# EAGLE design sheild (EAGLE 5.10)
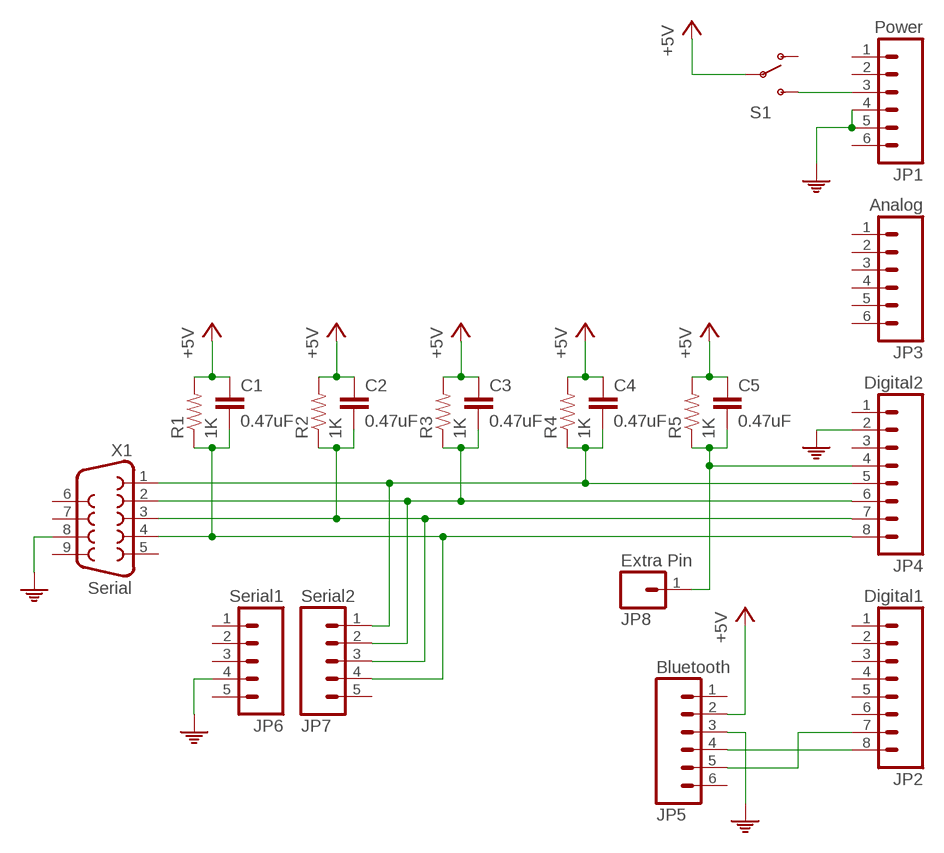
[diagram p0: schematic, sheet 1]

## Parts
C1  0.47uF  CAP0603-CAP  [0603-CAP]
C2  0.47uF  CAP0603-CAP  [0603-CAP]
C3  0.47uF  CAP0603-CAP  [0603-CAP]
C4  0.47uF  CAP0603-CAP  [0603-CAP]
C5  0.47uF  CAP0603-CAP  [0603-CAP]
JP1  Power  M06SIP  [1X06]
JP2  Digital1  M08  [1X08]
JP3  Analog  M06SIP  [1X06]
JP4  Digital2  M08  [1X08]
JP5  Bluetooth  M06SIP  [1X06]
JP6  Serial1  M05  [1X05]
JP7  Serial2  M05  [1X05]
JP8  Extra Pin  M01PTH  [1X01]
R1  1K  RESISTOR0603-RES  [0603-RES]
R2  1K  RESISTOR0603-RES  [0603-RES]
R3  1K  RESISTOR0603-RES  [0603-RES]
R4  1K  RESISTOR0603-RES  [0603-RES]
R5  1K  RESISTOR0603-RES  [0603-RES]
S1  SWITCH-SPSTSMD  [AYZ0202]
X1  Serial  DB9  [DB9]

## Nets
+5V: C1.1 C2.1 C3.1 C4.1 C5.1 JP5.2 R1.2 R2.2 R3.2 R4.2 R5.2 S1.2(P)
N$1: JP2.8 JP5.4
N$2: JP2.7 JP5.5
N$3: JP1.3 S1.3(S)
N$4: C3.2 JP4.6 JP7.2 R3.1 X1.2
N$5: C4.2 JP4.5 JP7.1 R4.1 X1.1
N$6: C5.2 JP4.4 JP8.1 R5.1
N$16: C1.2 JP4.8 JP7.4 R1.1 X1.4
PE: JP1.4 JP1.5 JP4.2 JP5.3 JP6.4 X1.8
X1: C2.2 JP4.7 JP7.3 R2.1 X1.3
Unconnected: JP1.1 JP1.2 JP1.6 JP2.1 JP2.2 JP2.3 JP2.4 JP2.5 JP2.6 JP3.1 JP3.2 JP3.3 JP3.4 JP3.5 JP3.6 JP4.1 JP4.3 JP5.1 JP5.6 JP6.1 JP6.2 JP6.3 JP6.5 JP7.5 S1.1(O) X1.5 X1.6 X1.7 X1.9

## Library data of the parts
C1-C5 = SparkFun:CAP: Capacitor Standard 0603 ceramic capacitor, and 0.1" leaded capacitor.
JP1 JP3 JP5 = SparkFun-3-2-07:M06: Header 6 Standard 6-pin 0.1" header. Use with straight break away headers (SKU : PType-HD), right angle break away headers (PType-HD-RightAngle), swiss pins (PType-30F), machine pins (PType-MP), and female headers (PType-FH). Molex polarized connector foot print use with SKU : Con-Hdr with associated crimp pins and housings.
JP2 JP4 = SparkFun-3-2-07:M08: Header 8 Standard 8-pin 0.1" header. Use with straight break away headers (SKU : PType-HD), right angle break away headers (PType-HD-RightAngle), swiss pins (PType-30F), machine pins (PType-MP), and female headers (PType-FH). Molex polarized connector foot print use with SKU : Con-Hdr with associated crimp pins and housings.
JP6 JP7 = SparkFun-3-2-07:M05: Header 5 Standard 5-pin 0.1" header. Use with straight break away headers (SKU : PType-HD), right angle break away headers (PType-HD-RightAngle), swiss pins (PType-30F), machine pins (PType-MP), and female headers (PType-FH). Molex polarized connector foot print use with SKU : Con-Hdr with associated crimp pins and housings.
JP8 = SparkFun-3-2-07:M01: Header 1 Standard 1-pin 0.1" header. Use with straight break away headers (SKU : PType-HD), right angle break away headers (PType-HD-RightAngle), swiss pins (PType-30F), machine pins (PType-MP), and female headers (PType-FH).
R1-R5 = SparkFun:RESISTOR: Resistor Basic schematic elements and footprints for 0603, 1206, and PTH 1/10th watt (small) resistors.
S1 = SparkFun:SWITCH-SPST: SPST Switch Simple slide switch. Spark Fun Electronics SKU : COM-00102
X1 = SparkFun-3-2-07:DB9: DB9 Connector Standard DB9 (D-Sub 9) serial connector. Can be used for CAN bus as well as RS485 and RS232. Footprint production proven. Spark Fun Electronics SKU : PType-DB9-PCB

## Board
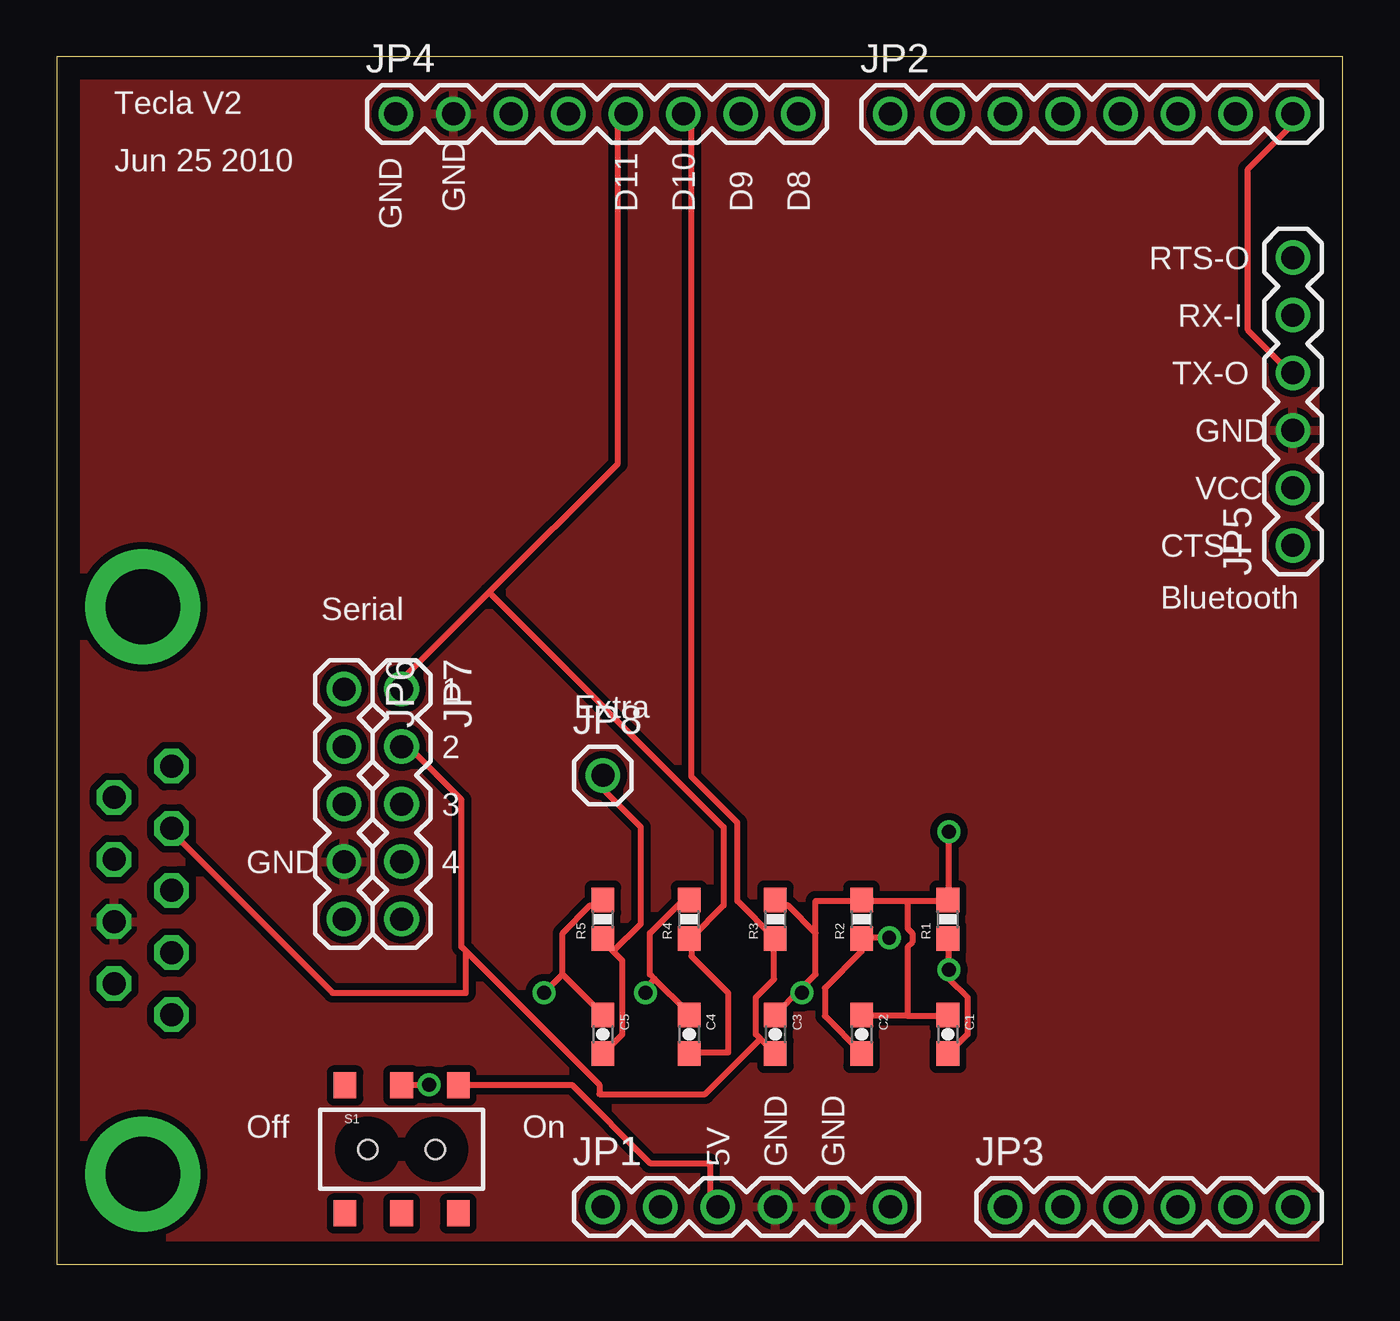
[diagram p1: board, top side]
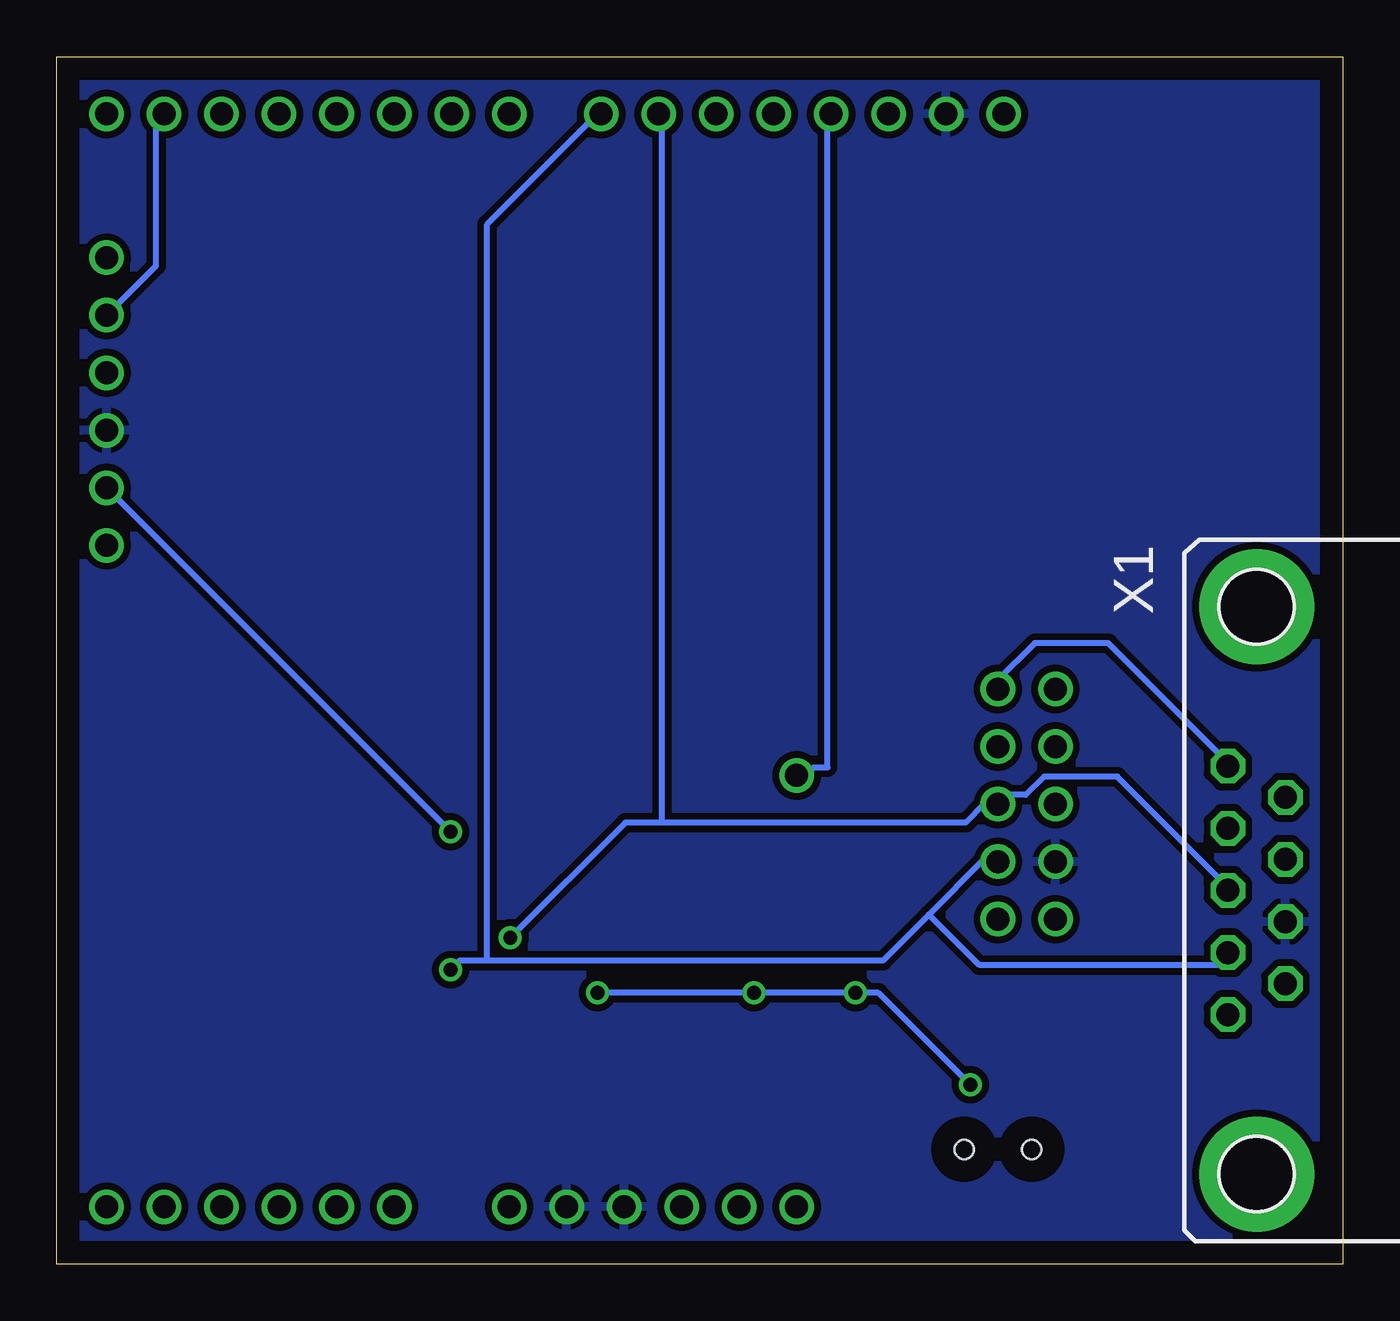
[diagram p2: board, bottom side, seen from below]

Size 56.82 x 53.33 mm. Coordinates in mm from the lower left corner, seen from the top.
Outline: 0,0 56.82,0 56.82,53.33 0,53.33 0,0
Copper layers (1*16): Top 0.035mm / dielectric 1.5mm / Bottom 0.035mm
Design rules "default *": minimum track width 10mil, minimum drill 24mil, track to track 8mil, track to pad 8mil, pad to pad 8mil, via to via 8mil, smd to smd 8mil, copper to edge 40mil, drill to drill 8mil, minimum pad ring 10mil, minimum via ring 8mil, stop-mask expansion 4mil, vias tented up to drill 0mil, thermal gap 10mil

### Footprints (pad centres in the part's own frame; a part is rotated, then mirrored left to right if it is on the bottom)
0603-CAP = smd 1.1 x 1: 1 -0.85,0; 2 0.85,0
1X06 = drill 1.016 round: 1 0,0; 2 2.54,0; 3 5.08,0; 4 7.62,0; 5 10.16,0; 6 12.7,0
1X08 = drill 1.016 round: 1 0,0; 2 2.54,0; 3 5.08,0; 4 7.62,0; 5 10.16,0; 6 12.7,0; 7 15.24,0; 8 17.78,0
1X05 = drill 1.016 round: 1 0,0; 2 2.54,0; 3 5.08,0; 4 7.62,0; 5 10.16,0
1X01 = drill 1.016 round: 1 0,0
0603-RES = smd 1.1 x 1: 1 -0.85,0; 2 0.85,0
AYZ0202 = smd 1 x 1.15: 1 -2.5,2.825; 2 0,2.825; 3 2.5,2.825; 4 -2.5,-2.825; 5 0,-2.825; 6 2.5,-2.825 | hole 0.85: 1.5,0; -1.5,0
DB9 = drill 1.016 octagon: 1 -5.486,-1.27; 2 -2.743,-1.27; 3 0,-1.27; 4 2.743,-1.27; 5 5.486,-1.27; 6 -4.115,1.27; 7 -1.372,1.27; 8 1.372,1.27; 9 4.115,1.27 | drill 3.302 pad 5.08 round: G1 -12.522,0; G2 12.522,0

### Placement (x,y rotation side)
C1  39.37,10.16 270 top
C2  35.56,10.16 270 top
C3  31.75,10.16 270 top
C4  27.94,10.16 270 top
C5  24.13,10.16 270 top
JP1  24.13,2.54 0 top
JP2  36.83,50.8 0 top
JP3  41.91,2.54 0 top
JP4  14.99,50.8 0 top
JP5  54.61,31.75 90 top
JP6  12.7,25.4 270 top
JP7  15.24,25.4 270 top
JP8  24.13,21.59 0 top
R1  39.37,15.24 90 top
R2  35.56,15.24 90 top
R3  31.75,15.24 90 top
R4  27.94,15.24 90 top
R5  24.13,15.24 90 top
S1  15.24,5.08 0 top
X1  3.81,16.51 270 bottom

### Tracks (layer width: path | path; a pad name or v marks a point on that pad's centre or on a via)
+5V  (via drill 0.61)
  Top 0.254: 26.42,12.6 26.21,12.8 26.21,14.63 27.84,16.26 R4.2 | 26.42,12.6 27.84,11.18 C4.1 | 22.35,12.8 23.98,11.18 C5.1 | 22.35,12.8 22.35,14.63 23.57,15.85 23.98,15.85 23.98,16.05 R5.2 | v16.46,7.92 15.24,7.92 S1.2 | v21.54,11.99 22.35,12.8 | 26.42,12.6 26.01,12.19 v26.01,11.99 | 37.59,10.97 39.22,10.97 C1.1 | 37.59,10.97 35.56,10.97 C2.1 | 32.72,11.99 33.53,12.8 33.53,14.63 | 32.72,11.99 31.9,11.18 C3.1 | 33.53,14.63 32.31,15.85 31.9,15.85 31.9,16.05 R3.2 | 35.56,16.05 33.53,16.05 33.53,14.63 | 35.56,16.05 37.59,16.05 | 37.59,16.05 39.22,16.05 R1.2 39.42,16.26 v39.42,19.1 | 35.56,16.05 R2.2 | 37.59,10.97 37.59,14.02 37.8,14.22 37.8,14.63 37.59,14.83 37.59,16.05 | v32.92,11.99 32.72,11.99
  Bottom 0.254: v16.46,7.92 20.52,11.99 v21.54,11.99 v26.01,11.99 v32.92,11.99 | v39.42,19.1 JP5.2
N$1
  Top 0.254: JP5.4 54.46,39.42 52.63,41.25 52.63,48.36 54.46,50.19 54.46,50.8 JP2.8
N$2
  Bottom 0.254: JP5.5 52.43,44.09 52.43,50.8 JP2.7
N$3
  Top 0.254: S1.3 17.88,7.92 22.76,7.92 26.21,4.47 28.85,4.47 28.85,2.85 29.06,2.64 JP1.3
N$4
  Top 0.254: 31.09,9.96 30.89,10.16 30.89,11.79 31.7,12.6 31.7,14.22 R3.1 31.7,14.43 30.07,16.05 30.07,19.51 28.04,21.54 28.04,50.6 27.84,50.8 JP4.6 | 31.09,9.96 31.7,9.35 C3.2 | 31.09,9.96 28.65,7.52 23.98,7.52 23.98,7.92 18.09,13.82 | 18.09,13.82 17.88,14.02 17.88,20.52 15.65,22.76 15.24,22.76 JP7.2 | 18.09,13.82 18.09,11.99 12.19,11.99 5.08,19.1 X1.2
N$5
  Top 0.254: C4.2 28.04,9.35 29.67,9.35 29.67,11.99 28.04,13.61 28.04,14.22 R4.1 28.04,14.43 29.46,15.85 29.46,19.3 19.1,29.67 | 19.1,29.67 15.24,25.81 JP7.1 | 19.1,29.67 24.79,35.36 24.79,50.6 24.99,50.8 JP4.5
  Bottom 0.254: JP7.1 15.24,25.81 13.61,27.43 10.36,27.43 5.08,22.15 X1.1
N$6
  Top 0.254: C5.2 24.18,9.35 24.99,10.16 24.99,13.41 24.59,13.82 | 24.59,13.82 24.18,14.22 R5.1 | 24.59,13.82 25.81,15.04 25.81,19.3 24.18,20.93 24.18,21.54 JP8.1
  Bottom 0.254: JP4.4 22.76,50.8 22.76,21.95 23.37,21.95 23.57,21.74 23.98,21.74 JP8.1
N$16  (via drill 0.61)
  Top 0.254: C1.2 39.42,9.35 40.23,10.16 40.23,11.79 39.42,12.6 v39.42,13.01 39.42,14.22 R1.1
  Bottom 0.254: v39.42,13.01 39.01,13.41 37.8,13.41 | 37.8,13.41 20.32,13.41 18.29,15.44 | 18.29,15.44 15.85,17.88 15.24,17.88 JP7.4 | 18.29,15.44 16.05,13.21 5.49,13.21 5.08,13.61 X1.4 | 37.8,13.41 37.8,45.92 32.92,50.8 JP4.8
PE
  pour Bottom (isolate 0.305): 0,53.34 57.15,53.34 57.15,0 0,0 0,52.07
  pour Top (isolate 0.305): 0,53.34 57.15,53.34 57.15,0 0,0
X1  (via drill 0.61)
  Top 0.254: C2.2 35.56,9.35 33.93,10.97 33.93,12.19 35.56,13.82 R2.1 35.56,14.43 v36.78,14.43
  Bottom 0.254: X1.3 5.08,16.66 9.96,21.54 13.21,21.54 14.02,20.73 14.83,20.73 JP7.3 15.85,20.32 16.66,19.51 30.07,19.51 | 30.07,19.51 30.07,50.8 JP4.7 | v36.78,14.43 31.7,19.51 30.07,19.51

### Text on the board
tPlace: Tecla V2 | Jun 25 2010 | GND | GND | D11 | D10 | D9 | D8 | RTS-O | RX-I | TX-O | GND | VCC | CTS-I | Bluetooth | Serial | 1 | Extra | 2 | 3 | GND | 4 | Off | On | 5V | GND | GND